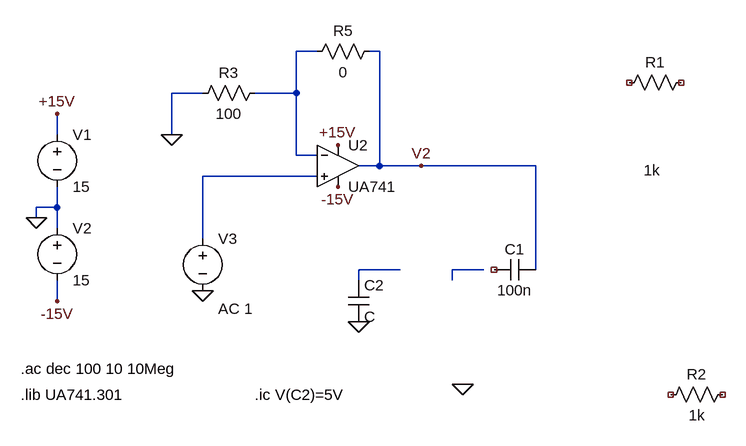
[diagram p0: schematic sim_part2_RC_ex4.asc]
sim_part2_RC_ex4.asc, the LTspice schematic file:
Version 4
SHEET 1 880 680
WIRE 144 -144 112 -144
WIRE 240 -144 224 -144
WIRE -32 -80 -80 -80
WIRE 112 -80 112 -144
WIRE 112 -80 48 -80
WIRE -256 -16 -256 -48
WIRE -80 -16 -80 -80
WIRE 112 16 112 -80
WIRE 144 16 112 16
WIRE 240 32 240 -144
WIRE 240 32 208 32
WIRE 304 32 240 32
WIRE 480 32 304 32
WIRE 144 48 -32 48
WIRE -256 96 -256 64
WIRE -256 96 -288 96
WIRE -288 112 -288 96
WIRE -256 128 -256 96
WIRE -32 144 -32 48
WIRE 272 192 208 192
WIRE 400 192 352 192
WIRE 480 192 480 32
WIRE 208 208 208 192
WIRE 352 208 352 192
WIRE -256 240 -256 208
FLAG -288 112 0
FLAG -256 -48 +15V
FLAG -256 240 -15V
FLAG 176 0 +15V
FLAG 176 64 -15V
FLAG 304 32 V2
FLAG -80 -16 0
FLAG -32 224 0
FLAG 368 368 0
FLAG 208 272 0
SYMBOL voltage -256 -32 R0
WINDOW 123 0 0 Left 0
WINDOW 39 0 0 Left 0
SYMATTR InstName V1
SYMATTR Value 15
SYMBOL voltage -256 112 R0
WINDOW 123 0 0 Left 0
WINDOW 39 0 0 Left 0
SYMATTR InstName V2
SYMATTR Value 15
SYMBOL res 240 -160 R90
WINDOW 0 0 56 VBottom 2
WINDOW 3 32 56 VTop 2
SYMATTR InstName R5
SYMATTR Value 0
SYMBOL OpAmps\\opamp2 176 -32 R0
SYMATTR InstName U2
SYMATTR Value UA741
SYMBOL res 64 -96 R90
WINDOW 0 0 56 VBottom 2
WINDOW 3 32 56 VTop 2
SYMATTR InstName R3
SYMATTR Value 100
SYMBOL voltage -32 128 R0
WINDOW 123 24 124 Left 2
WINDOW 39 0 0 Left 0
SYMATTR Value2 AC 1
SYMATTR InstName V3
SYMATTR Value ""
SYMBOL res 720 -112 R90
WINDOW 0 0 56 VBottom 2
WINDOW 3 135 61 VTop 2
SYMATTR InstName R1
SYMATTR Value 1k
SYMBOL cap 480 176 R90
WINDOW 0 0 32 VBottom 2
WINDOW 3 32 32 VTop 2
SYMATTR InstName C1
SYMATTR Value 100n
SYMBOL res 784 368 R90
WINDOW 0 0 56 VBottom 2
WINDOW 3 32 56 VTop 2
SYMATTR InstName R2
SYMATTR Value 1k
SYMBOL cap 192 208 R0
SYMATTR InstName C2
TEXT -312 344 Left 2 !.ac dec 100 10 10Meg
TEXT -312 384 Left 2 !.lib UA741.301
TEXT 48 384 Left 2 !.ic V(C2)=5V

The netlist it stands for:
* sim_part2_RC_ex4.asc
V1 +15V 0 15
V2 0 -15V 15
R5 V2 N001 0
XU2 N002 N001 +15V -15V V2 UA741  ; pins In+ In- V+ V- OUT
R3 N001 0 100
V3 N002 0 AC 1
R1 NC_01 NC_02 1k
C1 V2 NC_03 100n
R2 NC_04 NC_05 1k
C2 N003 0 C
.ac dec 100 10 10Meg
.lib UA741.301
.ic V(C2)=5V
.backanno
.end